# Altium schematic sheet EEPROM.SchDoc: Title
size A4; Author: Adam Mizerkiewicz; CompanyName: Adam Mizerkiewicz; DrawnBy: Adam Mizerkiewicz; Engineer: Adam Mizerkiewicz; Organization: Adam Mizerkiewicz; Address1: Sarnia 2/19; Address2: 61-058 Poznań; Revision: 0.0; SheetNumber: 18; SheetTotal: 18
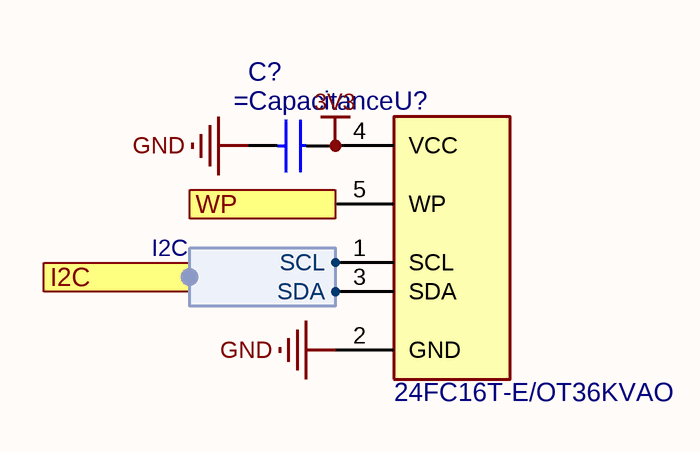
[diagram p0: EEPROM.SchDoc]

## Parts
C?  (no value)  [C0402]
U?  24FC16T-E/OT36KVAO  [SOT-23-5]

## Ports
I2C (harness I2C), WP (in)

## Harnesses
I2C: SDA, SCL

## Nets
3V3: C?.1 U?.4(VCC)
GND: C?.2 U?.2(GND)
WP: U?.5(WP) ; port WP
NetU?_1: U?.1(SCL) ; port I2C.SCL
NetU?_3: U?.3(SDA) ; port I2C.SDA

## Notes on the sheet
- Revision
  =Revision
- Sheet
  =SheetNumber / =SheetTotal

## Library data of the parts
C? = CAP0402-0.1uF-50V: CAP CER 0.1UF 50V X7R 0402; Manufacturer: Walsin Technologies; Manufacturer Part Number: 0402B104K500CT; Capacitance: 100nF; Material: 4241ConductorMaterial; Value: 100nF; Tolerance: 10%; Dielectric: 1511DielectricType; Supplier: Digikey; Supplier Part Number: 1292-1176-1-ND; RoHS: Yes; Category: Ceramic Capacitors; Stock: 109567; Pricing: 1=0,08, 10=0,005, 100=0,0032, 1000=0,0024 (USD); Mounting Technology: Surface Mount; Case/Package: 0402; Case Code (Imperial): 0402; Case Code (Metric): 1005; Min Operating Temperature: -55°C; Max Operating Temperature: 125°C; Packaging: Cut Tape; Voltage Rating: 50V; Series: -; Voltage Rating (DC): 50V; Height: 550um; RoHS Compliant: Yes; Lead Free: 5697LeadFree; ComponentLink1URL: http://datasheet.octopart.com/0402B104K500CT-Walsin-Technologies-datasheet-26371553.pdf?src-supplier=Arrow+Electronics; ComponentLink1Description: http://datasheet.octopart.com/0402B104K500CT-Walsin-Technologies-datasheet-26371553.pdf?src-supplier=Arrow+Electronics; ComponentLink2URL: http://datasheet.octopart.com/0402B104K500CT-Walsin-Technologies-datasheet-26371553.pdf?src-supplier=Verical; ComponentLink2Description: http://datasheet.octopart.com/0402B104K500CT-Walsin-Technologies-datasheet-26371553.pdf?src-supplier=Verical; ComponentLink3URL: http://www.passivecomponent.com/indexsea/0402B104K500CT-IE.pdf?src-supplier=Digikey; ComponentLink3Description: http://www.passivecomponent.com/indexsea/0402B104K500CT-IE.pdf?src-supplier=Digikey; ComponentLink4URL: http://datasheet.octopart.com/0402B104K500CT-Walsin-Technologies-datasheet-26371553.pdf?src-supplier=Rs; ComponentLink4Description: http://datasheet.octopart.com/0402B104K500CT-Walsin-Technologies-datasheet-26371553.pdf?src-supplier=Rs; ComponentLink5URL: https://datasheet.octopart.com/0402B104K500CT-Walsin-Technologies-datasheet-128065749.pdf?src-supplier=Future+Electronics; ComponentLink5Description: https://datasheet.octopart.com/0402B104K500CT-Walsin-Technologies-datasheet-128065749.pdf?src-supplier=Future+Electronics; ComponentLink6URL: http://datasheet.octopart.com/0402B104K500CT-Walsin-Technologies-datasheet-26371553.pdf?src-supplier=Farnell; ComponentLink6Description: http://datasheet.octopart.com/0402B104K500CT-Walsin-Technologies-datasheet-26371553.pdf?src-supplier=Farnell; ComponentLink7URL: http://datasheet.octopart.com/0402B104K500CT-Walsin-Technologies-datasheet-26371553.pdf?src-supplier=Newark; ComponentLink7Description: http://datasheet.octopart.com/0402B104K500CT-Walsin-Technologies-datasheet-26371553.pdf?src-supplier=Newark; ComponentLink8URL: http://datasheet.octopart.com/0402B104K500CT-Walsin-Technologies-datasheet-26371553.pdf?src-supplier=Mouser; ComponentLink8Description: http://datasheet.octopart.com/0402B104K500CT-Walsin-Technologies-datasheet-26371553.pdf?src-supplier=Mouser; ComponentLink9URL: http://datasheet.octopart.com/0402B104K500CT-Walsin-Technologies-datasheet-26371553.pdf?src-supplier=Digikey; ComponentLink9Description: http://datasheet.octopart.com/0402B104K500CT-Walsin-Technologies-datasheet-26371553.pdf?src-supplier=Digikey; ComponentLink10URL: https://datasheet.octopart.com/0402B104K500CT-Walsin-Technologies-datasheet-62066062.pdf?src-supplier=TME; ComponentLink10Description: https://datasheet.octopart.com/0402B104K500CT-Walsin-Technologies-datasheet-62066062.pdf?src-supplier=TME; ComponentLink11URL: http://datasheet.octopart.com/0402B104K500CT-Walsin-Technologies-datasheet-26371553.pdf?src-supplier=Freelance+Electronics; ComponentLink11Description: http://datasheet.octopart.com/0402B104K500CT-Walsin-Technologies-datasheet-26371553.pdf?src-supplier=Freelance+Electronics; ComponentLink12URL: http://datasheet.octopart.com/0402B104K500CT-Walsin-Technologies-datasheet-26371553.pdf?src-supplier=Component+Sense; ComponentLink12Description: http://datasheet.octopart.com/0402B104K500CT-Walsin-Technologies-datasheet-26371553.pdf?src-supplier=Component+Sense; ComponentLink13URL: http://datasheet.octopart.com/0402B104K500CT-Walsin-Technologies-datasheet-26371553.pdf?src-supplier=NAC+Semi; ComponentLink13Description: http://datasheet.octopart.com/0402B104K500CT-Walsin-Technologies-datasheet-26371553.pdf?src-supplier=NAC+Semi; ComponentLink14URL: https://datasheet.octopart.com/0402B104K500CT-Walsin-Technologies-datasheet-136037192.pdf?src-supplier=TECHDesign; ComponentLink14Description: https://datasheet.octopart.com/0402B104K500CT-Walsin-Technologies-datasheet-136037192.pdf?src-supplier=TECHDesign; Supplier 1: Digikey; Supplier Part Number 1: 1292-1176-1-ND
U? = 24FC16T-E/OT36KVAO: IC EEPROM 16KBIT I2C SOT23-5 EEPROM Memory IC 16Kbit I2C 1 MHz 450 ns SOT-23-5; Manufacturer: Microchip; Supplier 1: DigiKey; Supplier Part Number 1: 150-24FC16T-E/OT36KVAOTR-ND; Supplier: DigiKey; Supplier Part Number: 150-24FC16T-E/OT36KVAOTR-ND; Manufacturer Part Number: 24FC16T-E/OT36KVAO; Category: Memory; Pricing: 3000=0,34 (USD); Projected EOL Date: 2049-08-26; Case/Package: SOT-23; Country of Assembly: Thailand; Country of Fabrication: United States of America; Country of Origin: Thailand; Export Control Classification Number (ECCN) Code: EAR99; Harmonized Tariff Schedule (HTS) Code: 8542.32.0051; Introduction Date: 2021-08-26; Lifecycle Status: Production; Pins: 5; ComponentLink1URL: https://datasheet.octopart.com:443/24FC16T-E-OT36KVAO-Microchip-datasheet-159614128.pdf?src-supplier=Microchip; ComponentLink1Description: https://datasheet.octopart.com:443/24FC16T-E-OT36KVAO-Microchip-datasheet-159614128.pdf?src-supplier=Microchip; ComponentLink2URL: https://datasheet.octopart.com:443/24FC16T-E-OT36KVAO-Microchip-datasheet-185420243.pdf?src-supplier=Microchip; ComponentLink2Description: https://datasheet.octopart.com:443/24FC16T-E-OT36KVAO-Microchip-datasheet-185420243.pdf?src-supplier=Microchip; ComponentLink3URL: https://datasheet.octopart.com:443/24FC16T-E-OT36KVAO-Microchip-datasheet-138123575.pdf?src-supplier=Augswan; ComponentLink3Description: https://datasheet.octopart.com:443/24FC16T-E-OT36KVAO-Microchip-datasheet-138123575.pdf?src-supplier=Augswan; ComponentLink4URL: http://sigma.octopart.com:80/188449423/materials_sheet/Microchip-24FC16T-E-OT36KVAO.pdf?src-supplier=Compliance+Statements; ComponentLink4Description: http://sigma.octopart.com:80/188449423/materials_sheet/Microchip-24FC16T-E-OT36KVAO.pdf?src-supplier=Compliance+Statements; ComponentLink5URL: http://sigma.octopart.com:80/conflict_mineral_statement/Microchip-company-68.pdf?src-supplier=Compliance+Statements; ComponentLink5Description: http://sigma.octopart.com:80/conflict_mineral_statement/Microchip-company-68.pdf?src-supplier=Compliance+Statements; ComponentLink6URL: http://sigma.octopart.com:80/conflict_mineral_statement/Microchip-company-69.pdf?src-supplier=Compliance+Statements; ComponentLink6Description: http://sigma.octopart.com:80/conflict_mineral_statement/Microchip-company-69.pdf?src-supplier=Compliance+Statements; ComponentLink7URL: http://sigma.octopart.com:80/reach_statement/Microchip-company-70.pdf?src-supplier=Compliance+Statements; ComponentLink7Description: http://sigma.octopart.com:80/reach_statement/Microchip-company-70.pdf?src-supplier=Compliance+Statements; ComponentLink8URL: http://sigma.octopart.com:80/rohs_statement/Microchip-company-71.pdf?src-supplier=Compliance+Statements; ComponentLink8Description: http://sigma.octopart.com:80/rohs_statement/Microchip-company-71.pdf?src-supplier=Compliance+Statements